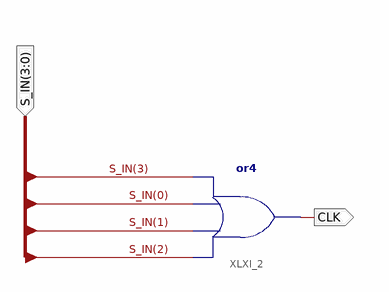
[diagram p0: schematic sheet 1]
// Xilinx ISE schematic create_clock.sch (spartan6) as structural Verilog: 1 symbols, 2 ports
module create_clock (
  input  [3:0] S_IN,
  output CLK
);

  or XLXI_2 (CLK, S_IN[2], S_IN[1], S_IN[0], S_IN[3]);
endmodule
